# Altium project motion_detection_door_lock.PrjPcb
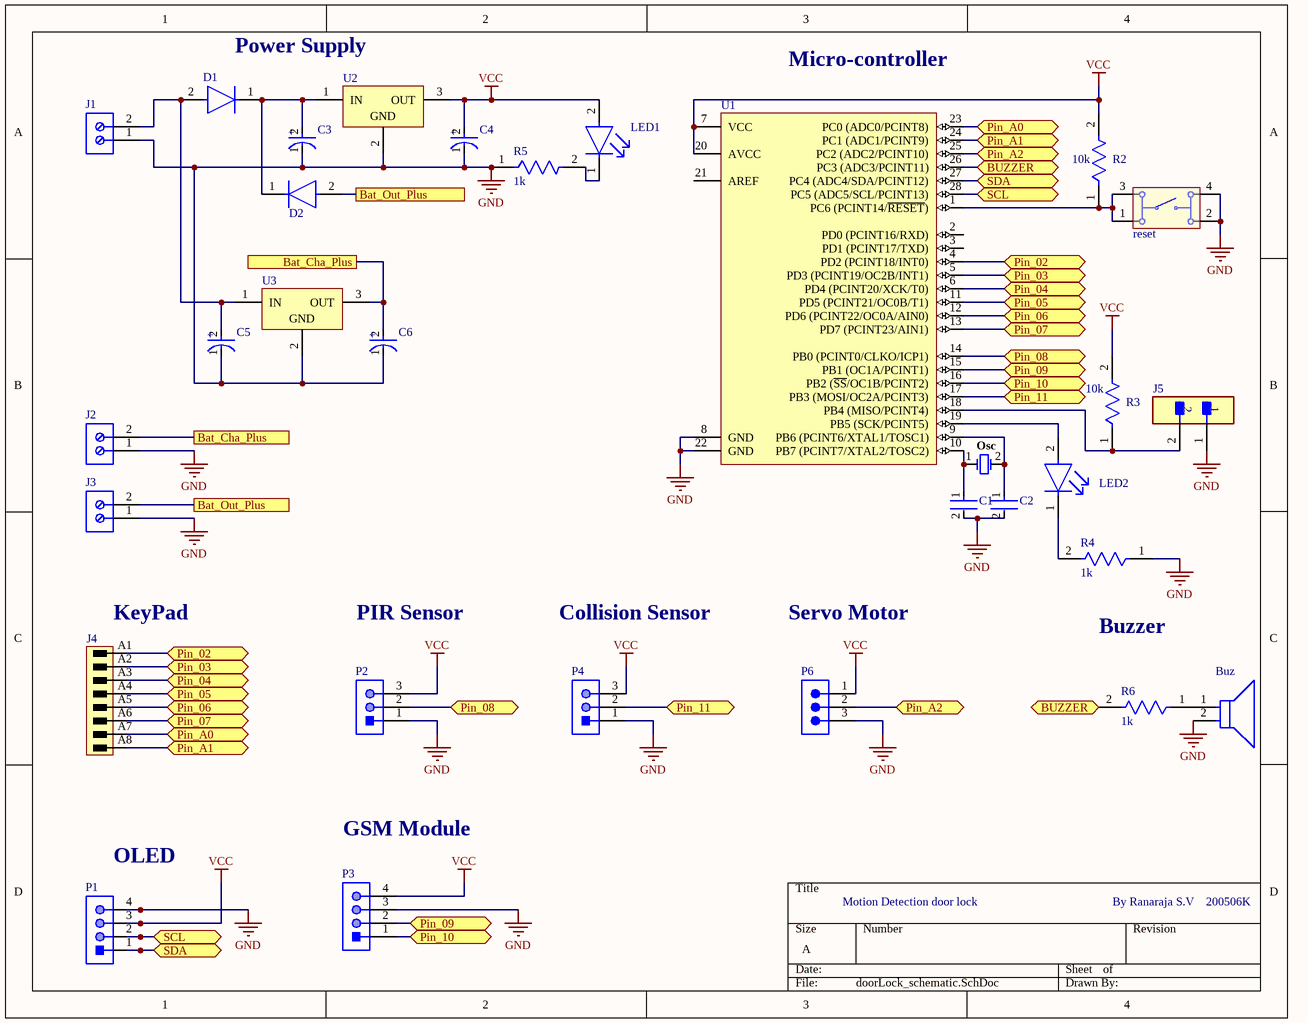
[diagram p0: doorLock_schematic.SchDoc]
1 sheet, 31 parts. Net scope: flat (ports and power ports of the same name join across sheets).
Board file: door_lock_pcb.PcbDoc

## Sheet doorLock_schematic.SchDoc
size A; SheetNumber: 1; SheetTotal: 1

### Parts
Buz  SD1614TT-B3M  [FP-SD1614TT-B3M-MFG]  (value not drawn)
C1  RCE5C2A220J0DBH03A  [FP-RCE0DB-MFG]  (value not drawn)
C2  RCE5C2A220J0DBH03A  [FP-RCE0DB-MFG]  (value not drawn)
C3  EEUFC1V151  [FP-RAD-TH-D_8_0_5-L_11_5-MFG]  (value not drawn)
C4  EEUFC1V151  [FP-RAD-TH-D_8_0_5-L_11_5-MFG]  (value not drawn)
C5  EEUFC1V151  [FP-RAD-TH-D_8_0_5-L_11_5-MFG]  (value not drawn)
C6  EEUFC1V151  [FP-RAD-TH-D_8_0_5-L_11_5-MFG]  (value not drawn)
D1  1N4007  [FP-1N4007-MFG]  (value not drawn)
D2  1N4007  [FP-1N4007-MFG]  (value not drawn)
J1  691102710002  [691102710002]  (value not drawn)
J2  691102710002  [691102710002]  (value not drawn)
J3  691102710002  [691102710002]  (value not drawn)
J4  1842380000  [SL_SMT_3_5_180G_08]  (value not drawn)
J5  TSW-102-07-F-S  [FP-TSW-102-07-F-S-MFG]  (value not drawn)
LED1  LG L29K-G2J1-24-Z  [FP-LG_L29K-MFG]  (value not drawn)
LED2  LG L29K-G2J1-24-Z  [FP-LG_L29K-MFG]  (value not drawn)
Osc  FOXSLF/160-20  [FOX-FOXSLF160-20]  (value not drawn)
P1  691311700104  [691311700104]  (value not drawn)
P2  691322110003  [691322110003]  (value not drawn)
P3  691311700104  [691311700104]  (value not drawn)
P4  691322110003  [691322110003]  (value not drawn)
P6  TSW-103-07-G-S  [SMTC-TSW-103-07-X-S]  (value not drawn)
R2  Resistance: 10k  [FP-MRS1600-MFG]  (hidden comment: MRS16000C2002FCT00)
R3  Resistance: 10k  [FP-MRS1600-MFG]  (hidden comment: MRS16000C2002FCT00)
R4  Resistance: 1k  [FP-MRS1600-MFG]  (hidden comment: MRS16000C2002FCT00)
R5  Resistance: 1k  [FP-MRS1600-MFG]  (hidden comment: MRS16000C2002FCT00)
R6  Resistance: 1k  [FP-MRS1600-MFG]  (hidden comment: MRS16000C2002FCT00)
reset  430156043726  [430156043726]  (value not drawn)
U1  ATmega328-PU  [28P3]  (value not drawn)
U2  L7805CV  [TO220]  (value not drawn)
U3  L7805CV  [TO220]  (value not drawn)

### Ports
Bat_Cha_Plus, Bat_Out_Plus, BUZZER (bidir), Pin_02 (bidir), Pin_03 (bidir), Pin_04 (bidir), Pin_05 (bidir), Pin_06 (bidir), Pin_07 (bidir), Pin_08 (bidir), Pin_09 (bidir), Pin_10 (bidir), Pin_11 (bidir), Pin_A0 (bidir), Pin_A1 (bidir), Pin_A2 (bidir), SCL (bidir), SDA (bidir)

### Nets
GND: Buz.2(A) C1.2 C2.2 C3.1(C) C4.1(C) C5.1(C) C6.1(C) J1.1 J2.1 J3.1 J5.1 P1.4 P2.1 P3.3 P4.1 P6.3 R4.1 R5.1 reset.2 reset.4 U1.8(GND) U1.22(GND) U2.2(GND) U3.2(GND)
VCC: C4.2(A) LED1.2(A) P1.3 P2.3 P3.4 P4.3 P6.1 R2.2 R3.2 U1.7(VCC) U1.20(AVCC) U2.3(OUT)
NetBuz_1: Buz.1(C) R6.1
NetC1_1: C1.1 Osc.1 U1.10(PB7_(PCINT7/XTAL2/TOSC2))
NetC2_1: C2.1 Osc.2 U1.9(PB6_(PCINT6/XTAL1/TOSC1))
NetC3_2: C3.2(A) D1.1(C) D2.1(C) U2.1(IN)
NetC5_2: C5.2(A) D1.2(A) J1.2 U3.1(IN)
NetC6_2: C6.2(A) J2.2 U3.3(OUT) ; port Bat_Cha_Plus
NetD2_2: D2.2(A) J3.2 ; port Bat_Out_Plus
NetJ4_A1: J4.A1 U1.4(PD2_(PCINT18/INT0)) ; port Pin_02
NetJ4_A2: J4.A2 U1.5(PD3_(PCINT19/OC2B/INT1)) ; port Pin_03
NetJ4_A3: J4.A3 U1.6(PD4_(PCINT20/XCK/T0)) ; port Pin_04
NetJ4_A4: J4.A4 U1.11(PD5_(PCINT21/OC0B/T1)) ; port Pin_05
NetJ4_A5: J4.A5 U1.12(PD6_(PCINT22/OC0A/AIN0)) ; port Pin_06
NetJ4_A6: J4.A6 U1.13(PD7_(PCINT23/AIN1)) ; port Pin_07
NetJ4_A7: J4.A7 U1.23(PC0_(ADC0/PCINT8)) ; port Pin_A0
NetJ4_A8: J4.A8 U1.24(PC1_(ADC1/PCINT9)) ; port Pin_A1
NetJ5_2: J5.2 R3.1 U1.18(PB4_(MISO/PCINT4))
NetLED1_1: LED1.1(C) R5.2
NetLED2_1: LED2.1(C) R4.2
NetLED2_2: LED2.2(A) U1.19(PB5_(SCK/PCINT5))
NetP1_1: P1.1 U1.27(PC4_(ADC4/SDA/PCINT12)) ; port SDA
NetP1_2: P1.2 U1.28(PC5_(ADC5/SCL/PCINT13)) ; port SCL
NetP2_2: P2.2 U1.14(PB0_(PCINT0/CLKO/ICP1)) ; port Pin_08
NetP3_1: P3.1 U1.16(PB2_(~{SS}/OC1B/PCINT2)) ; port Pin_10
NetP3_2: P3.2 U1.15(PB1_(OC1A/PCINT1)) ; port Pin_09
NetP4_2: P4.2 U1.17(PB3_(MOSI/OC2A/PCINT3)) ; port Pin_11
NetP6_2: P6.2 U1.25(PC2_(ADC2/PCINT10)) ; port Pin_A2
NetR2_1: R2.1 reset.1 reset.3 U1.1(PC6_(PCINT14/~{RESET}))
NetR6_2: R6.2 U1.26(PC3_(ADC3/PCINT11)) ; port BUZZER

Not connected (* = marked no-connect by the designer): U1 2(PD0_(PCINT16/RXD)) 3(PD1_(PCINT17/TXD)) 21(AREF)

### Notes on the sheet
- Power Supply
- Micro-controller
- (near J4) KeyPad
- PIR Sensor
- Collision Sensor
- Servo Motor
- Buzzer
- GSM Module
- (near P1) OLED
- Motion Detection door lock
- By Ranaraja S.V    200506K
- (in symbol CMP-05427-001656-1) +

### Library data of the parts
Buz = CMP-08413-000011-1: AUDIO MAGNETIC XDCR 6-16V TH; Voltage Rating: 12V; Frequency: 2.048kHz; Operating Supply Current: 100mA; Operating Supply Voltage: 15V; Washable: No; Lead Free: Lead Free; Packaging: Bulk; Sensing Method: Magnetic; Mount: Through Hole; Max Operating Temperature: 85°C; Min Operating Temperature: -40°C; Diameter: 16mm; Termination: PC Pins; Height: 11mm; Series: SD; Height - Seated (Max): 0.551inch; Package Quantity: 240; Max Supply Current: 100mA
C1 C2 = CMP-06035-047347-1: Cap Ceramic 22pF 100V C0G ±5% Radial 2.5mm +125°C Ammo Pack; Lead Diameter: 0.5mm; Lead/Base Style: Straight; Height: 3.5mm; Voltage: 100V; Mount: Through Hole; Min Operating Temperature: -55°C; Height - Seated (Max): 0.138inch; Dielectric: C0G; Width: 0.098inch; Depth: 2.5mm; Lead Pitch: 0.098inch; Packaging: Tape and Reel; Voltage Rating (DC): 100V; Capacitance: 22pF; Package Quantity: 2000; Max Operating Temperature: 125°C; Tolerance: 5%; Termination: Radial; Voltage Rating: 100V; Case/Package: Radial; Resistor Type: Ceramic; Length: 3.6mm; Ratings: AEC-Q200
C3 C5 = CMP-05427-001656-1: Aluminum Electrolytic Capacitors (Radial Lead Type) AEC-Q200 Qualified 150uF ±20% 35V; Lead Diameter: 0.6mm; Dielectric Material: Aluminium; ESR (Equivalent Series Resistance): 117mR; Life (Hours): 2000Hour; Capacitance: 1uF; Polarity: Polar; Ripple Current: 555mA; Leakage Current: 3uA; Size: 11.5mm; Min Operating Temperature: -55°C; Height - Seated (Max): 0.453inch; REACH SVHC: No SVHC; Packaging: Bulk; Ratings: AEC-Q200; Max Operating Temperature: 105°C; Lead Free: Lead Free; Package Quantity: 200; Contact Plating: Tin; Diameter: 8mm; Case/Package: Radial; Impedance: 117mR; RoHS Compliant: Yes; Voltage Rating: 35V; Voltage: 35V; Height: 11.5mm; Length: 11mm; Construction: RADIAL; Radiation Hardening: No; Series: FC; Tolerance: 20%; Mount: Through Hole; Lead Pitch: 3.5mm; Voltage Rating (DC): 35V; Termination: Radial
C4 C6 = CMP-05427-001656-1: Aluminum Electrolytic Capacitors (Radial Lead Type) AEC-Q200 Qualified 150uF ±20% 35V; Lead Diameter: 0.6mm; Dielectric Material: Aluminium; ESR (Equivalent Series Resistance): 117mR; Life (Hours): 2000Hour; Capacitance: 10uF; Polarity: Polar; Ripple Current: 555mA; Leakage Current: 3uA; Size: 11.5mm; Min Operating Temperature: -55°C; Height - Seated (Max): 0.453inch; REACH SVHC: No SVHC; Packaging: Bulk; Ratings: AEC-Q200; Max Operating Temperature: 105°C; Lead Free: Lead Free; Package Quantity: 200; Contact Plating: Tin; Diameter: 8mm; Case/Package: Radial; Impedance: 117mR; RoHS Compliant: Yes; Voltage Rating: 35V; Voltage: 35V; Height: 11.5mm; Length: 11mm; Construction: RADIAL; Radiation Hardening: No; Series: FC; Tolerance: 20%; Mount: Through Hole; Lead Pitch: 3.5mm; Voltage Rating (DC): 35V; Termination: Radial
D1 D2 = CMP-123542-000001-1: Rectifier diode 1000 V 1 A DO-41, ,; Manufacturer: Diotec; Max Surge Forward Current: 27A; Forward Current: 1A; Max Junction Temp: +175°C; Reverse Voltage: 1000V; Value: 15pF; Peak Reverse Current: 5uA; Category: Diode; Temperature Range Low: -50°C; Automotive: No; Temperature: -50°C to +175°C; Lead Free: Yes; ComponentLink2Description: Datasheet; Max Repetitive Reverse Voltage: 1000V; ComponentLink2URL: https://datasheet.octopart.com/1N4007-Diotec-datasheet-62346875.pdf; Manufacturer Part Number: 1N4007; Device Class L3: Rectifier Diodes; Height: 2.8mm; Octopart: https://octopart.com/1n4007-diotec-4040411; Package: 1N4007; Temperature Range High: +175°C; Device Class L1: Discrete Semiconductors; Device Class L2: Diodes; RoHS: TRUE; Capacitance: 15pF; Ipc Land Pattern Name: DIOAD888W100L520D280
J1-J3 = CMP-1502-03258-1: Series 102 - 5.00 mm Horizontal Entry Modular with Pressure Clamp WR-TBL, 2 pin; Manufacturer: Wurth Elektronik; Pin Number: 2; Pitch: 5.00mm; Manufacturer URL: http://www.we-online.de; Mounting Technology: THT; Publisher: WurthElektronik; Packaging: Box; Package Reference: 691102710002; Datasheet URL: http://katalog.we-online.de/em/datasheet/6911027100xx.pdf; Operating Temperature: -40to105degC; Part Number: 691102710002
J4 = CMP-1559-01143-1: OMNIMATE Signal - series BL/SL 3.50; Manufacturer: Weidmueller; Rated_current_min_no_of_poles_TU_20_deg_C: 15 A; Contact_surface: tinned; Rated_voltage_for_surge_voltage_class_pollution_degree_II_2: 320 V; Side_termination_characteristic: closed side; Insulating_material: LCP GF; Rated_current_use_group_B_UL_1059: 10 A; Pitch_inch: 0.138 inch; Mounting_onto_the_PCB: Reflow solder connection; Short_text_for_material: SL-SMT 3.50/08/180G 3.2SN BK BX; No_of_poles: 8; Rated_voltage_use_group_B_UL_1059: 300 V; Pitch_mm: 3.5 mm; Solder_pin_length_mm: 3.2 mm; UL_94_flammability_rating: V-0; Outgoing_elbow: 180°; ComponentLink1URL: http://www.weidmueller.com/; ComponentLink2Description: URL Link1; Qty: 50 PCS; PackageReference: SL_SMT_3_5_180G_08; ComponentLink1Description: Manufacturer URL; Packaging: Box; ComponentLink2URL: http://catalog.weidmueller.com/catalog/Start.do?localeId=en&ObjectID=1842380000; Revision: V1; PartNumber: 1842380000; Colour: Black
J5 = CMP-02766-001458-1: CONN HEADER VERT 2POS 2.54MM; Gender: Male; Max Current Rating: 7.6A; Number of Contacts: 2; Max Voltage Rating (AC): 550V; Orientation: Straight; Depth: 2.54mm; Series: TSW; Package Quantity: 1; Min Operating Temperature: -55°C; Max Operating Temperature: 125°C; Contact Type: Male Pin; Contact Shape: Square; Color: Black; Housing Color: Black; Connector Type: Header; Fastening Type: Pull; Radiation Hardening: No; Pitch: 2.54mm; Housing Material: Polyester; Mount: Through Hole; Number of Positions: 2; Number of Rows: 1; Contact Material: Bronze; Insulation Color: Black; Contact Finish - Mating: GOLD; Termination: Solder; Insulation Material: PBT; Length: 5.08mm; Flammability Rating: UL94 V-0; Contact Mating Length: 0.23inch; REACH SVHC: No SVHC; Contact Plating: Gold; RoHS Compliant: Yes; Packaging: Bulk
LED1 LED2 = CMP-62016-000024-1: LED GREEN DIFFUSED 0603 SMD; Number of LEDs: 1; Forward Current: 20mA; Luminous Intensity: 5.6mcd; Luminous Flux: 0.012lm; Dominant Wavelength: 570nm; Lens Style: Flat; Forward Voltage: 2.2V; Reverse Voltage: 12V; Viewing Angle: 160°; Lens Size: 0.8mm; Test Current: 2mA; Lens Color: White; Length: 1.3mm; Radiation Hardening: No; Color: Green; Number of Pins: 2; Depth: 0.8mm; Number of Elements: 1; Case Code (Metric): 1608; Case Code (Imperial): 0603; Illumination Color: Green; Width: 0.8mm; Lens Transparency: Diffused; Mount: Surface Mount; Min Operating Temperature: -40°C; Packaging: Tape and Reel; Max Operating Temperature: 100°C; Case/Package: 0603; Height: 0.65mm; Package Quantity: 5000
Osc = CMP-1749-00003-1: Resistance Weld Thru-Hole Crystal, 16 MHz, -20 to 70 degC, 2-Pin THD, RoHS, Bulk; Voltage Rating: 250 V; Tolerance: 1%; Resistance: 221 kohm; Case\Package: Axial; Power Rating: 250 mW; RoHSCompliant: true; Package Quantity: 200; Packaging: Bulk; Min Operating Temperature: -55 degC; DatasheetVersion: Mar-15; ComponentLink1URL: http://www.foxonline.com/; Max Operating Temperature: 155 degC; PackageReference: FOXSLF160-20; Mount: Through Hole; PackageDescription: 2-Pin Through Hole Device, Body 11.35 x 4.65 mm; ComponentLink1Description: Manufacturer URL; ComponentLink2URL: http://www.foxonline.com/pdfs/hc49slf.pdf; ComponentLink2Description: Datasheet; Length: 0.248 inch
P1 P3 = CMP-1502-02035-1: Serie 3117 - 5.00mm Close Vertical PCB Header WR-TBL, 4 pin; Manufacturer: Wurth Elektronik; Pin Number: 4; Gender: Male; Publisher: WurthElektronik; Operating Temperature: -40to105degC; Package Reference: 691311700104; Mounting Technology: THT; Manufacturer URL: http://www.we-online.de; Packaging: Box; Pitch: 5.00mm; Part Number: 691311700104; Datasheet URL: http://katalog.we-online.de/em/datasheet/6913117001xx.pdf
P2 P4 = CMP-1502-01792-1: Serie 3221 - 3.50mm Horizontal PCB Header WR-TBL, 3 pin; Manufacturer: Wurth Elektronik; Pin Number: 3; Gender: Male; Part Number: 691322110003; Pitch: 3.50mm; Manufacturer URL: http://www.we-online.de; Packaging: Box; Operating Temperature: -40to105degC; Datasheet URL: http://katalog.we-online.de/em/datasheet/6913221100xx.pdf; Publisher: WurthElektronik; Mounting Technology: THT; Package Reference: 691322110003
P6 = CMP-1024-00333-1: 0.025" SQ Post Header, Through-hole, Vertical, -55 to 125 degC, 2.54 mm Pitch, 3-Pin, Male, RoHS; Manufacturer: Samtec; Pitch: 2.54 mm; ComponentLink3URL: http://www.samtec.com/documents/webfiles/cpdf/TSW-XXX-XX-XXX-X-XX-XXX-MKT.pdf; Temperature Range: -55 to 125 degC; DatasheetVersion: F-214; ComponentLink1Description: Manufacturer URL; ComponentLink2URL: http://www.samtec.com/documents/webfiles/pdf/TSW_TH.PDF; RoHS: True; Orientation: Vertical; ComponentLink2Description: Datasheet; ComponentLink3Description: Package Specification; PackageDescription: .025[0.64] SQ. Post Terminal Strip Assembly; Mounting Technology: Through-hole; PackageVersion: DM, 8/1988; ComponentLink1URL: http://www.samtec.com; PackageReference: TSW-103-07-X-S; PartNumber: TSW-103-07-G-S
R2-R6 = CMP-02408-000019-1: RES 20K OHM 0.4W 1% AXIAL; Max Power Dissipation: 400mW; Temperature Coefficient: 50ppm/°C; Technology: THIN FILM; Max Operating Temperature: 155°C; Number of Terminations: 2; RoHS Compliant: Yes; Packaging: Tape and Reel; Radiation Hardening: No; Contact Plating: Tin; Military Standard: Not; Construction: Cylindrical; Diameter: 1.6mm; Tolerance: 1%; Mount: Through Hole; Power Rating: 400mW; Case/Package: Conformal; Termination: Axial; Length: 3.6mm; Min Operating Temperature: -55°C; Resistor Type: Metal Film; Series: MRS16
reset = CMP-1453-00001-1: WS-TATV THT Tact Switch 6X6 mm; Manufacturer: Wuerth Elektronik; NoPins: 04; ComponentLink1URL: http://www.we-online.com; ComponentLink2Description: Datasheet; ComponentLink1Description: Manufacturer URL; PackageReference: 430156043726; ComponentLink2URL: http://katalog.we-online.de/em/datasheet/4301x6.pdf; PartNumber: 430156043726
U1 = CMP-0095-00015-2: 8-bit AVR Microcontroller, 32KB Flash, 1KB EEPROM, 2KB SRAM, 28-pin PDIP, Industrial Grade (-40°C to 85°C); ComponentLink3Description: ATmega48A/48PA/88A/88PA/168A/168PA/328/328P Summary; RevisionNote: DatasheetVersion updated. URLs added.; DatasheetVersion: revD, May-2011; ComponentLink1URL: http://www.atmel.com/; PackageVersion: revB, Sep-2001; PackageDescription: 28-lead (0.300"/7.62mm Wide) Plastic Dual Inline Package (PDIP); PackageReference: 28P3; ComponentLink1Description: Manufacturer URL; ComponentLink2Description: ATmega48A/48PA/88A/88PA/168A/168PA/328/328P Datasheet; ComponentLink3URL: http://www.atmel.com/dyn/resources/prod_documents/8271S.pdf; ComponentLink2URL: http://www.atmel.com/dyn/resources/prod_documents/8271.pdf
U2 U3 = CMP-0244-00483-1: Positive Voltage Regulator, 5V, 3-Pin TO-220; PackageDescription: TO, Thru-Hole, Vertical, Heatsink Mounted; 3 In-Line Leads; Pitch 2.54 mm; ComponentLink2Description: Datasheet; PackageReference: TO220; ComponentLink3URL: http://www.st.com/internet/com/TECHNICAL_RESOURCES/TECHNICAL_LITERATURE/PACKAGE_INFORMATION/CD00004649.pdf; DatasheetVersion: 16/11/2011; ComponentLink1Description: Manufacturer URL; ComponentLink1URL: http://www.st.com; PackageVersion: ver3.0; ComponentLink3Description: Package Specification; ComponentLink2URL: http://www.st.com/internet/com/TECHNICAL_RESOURCES/TECHNICAL_LITERATURE/DATASHEET/CD00000444.pdf